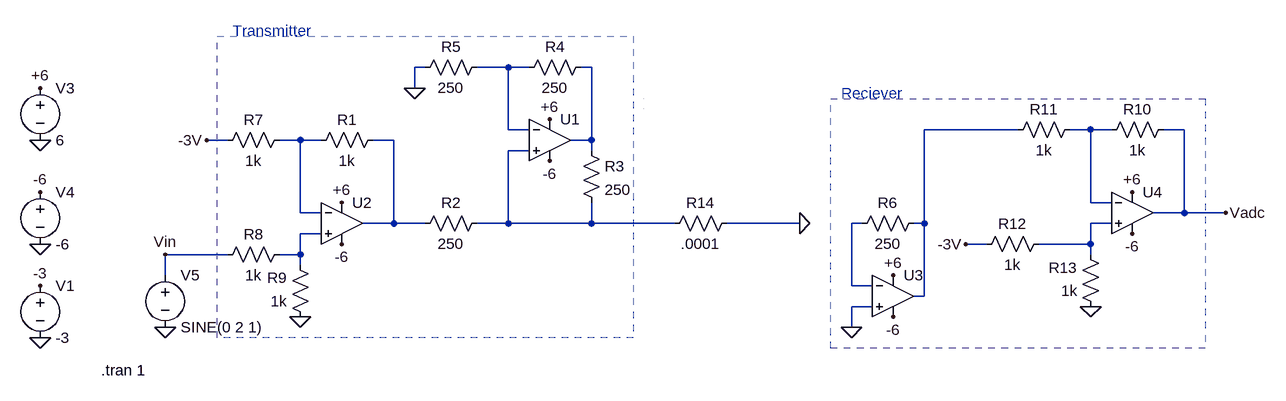
[diagram p0: schematic Draft1.asc]
Draft1.asc, the LTspice schematic file:
Version 4
SHEET 1 2096 688
WIRE 816 48 800 48
WIRE 944 48 896 48
WIRE 976 48 944 48
WIRE 1072 48 1056 48
WIRE 800 80 800 48
WIRE 944 144 944 48
WIRE 976 144 944 144
WIRE 1728 144 1584 144
WIRE 1840 144 1808 144
WIRE 1872 144 1840 144
WIRE 1984 144 1952 144
WIRE 512 160 480 160
WIRE 624 160 592 160
WIRE 656 160 624 160
WIRE 768 160 736 160
WIRE 1072 160 1072 48
WIRE 1072 160 1040 160
WIRE 976 176 944 176
WIRE 1072 176 1072 160
WIRE 1840 256 1840 144
WIRE 1872 256 1840 256
WIRE 624 272 624 160
WIRE 656 272 624 272
WIRE 1984 272 1984 144
WIRE 1984 272 1936 272
WIRE 2048 272 1984 272
WIRE 768 288 768 160
WIRE 768 288 720 288
WIRE 816 288 768 288
WIRE 944 288 944 176
WIRE 944 288 896 288
WIRE 1072 288 1072 256
WIRE 1072 288 944 288
WIRE 1200 288 1072 288
WIRE 1392 288 1280 288
WIRE 1488 288 1472 288
WIRE 1584 288 1584 144
WIRE 1584 288 1568 288
WIRE 1872 288 1840 288
WIRE 656 304 624 304
WIRE 1680 320 1648 320
WIRE 1840 320 1840 288
WIRE 1840 320 1760 320
WIRE 512 336 416 336
WIRE 624 336 624 304
WIRE 624 336 592 336
WIRE 1840 336 1840 320
WIRE 624 352 624 336
WIRE 416 368 416 336
WIRE 1472 384 1472 288
WIRE 1504 384 1472 384
WIRE 1584 400 1584 288
WIRE 1584 400 1568 400
WIRE 1504 416 1472 416
WIRE 1472 448 1472 416
FLAG 800 80 0
FLAG 224 320 0
FLAG 224 160 0
FLAG 688 256 +6
FLAG 688 320 -6
FLAG 416 448 0
FLAG 624 432 0
FLAG 1472 448 0
FLAG 1840 416 0
FLAG 1536 432 -6
FLAG 1008 192 -6
FLAG 1904 304 -6
FLAG 1008 128 +6
FLAG 1904 240 +6
FLAG 1536 368 +6
FLAG 224 240 -6
FLAG 224 80 +6
FLAG 480 160 -3V
FLAG 1648 320 -3V
FLAG 224 464 0
FLAG 224 384 -3
FLAG 2048 272 Vadc
FLAG 416 336 Vin
FLAG 1392 288 0
SYMBOL OpAmps\\UniversalOpamp2 1008 160 R0
SYMATTR InstName U1
SYMBOL res 912 272 R90
WINDOW 0 0 56 VBottom 2
WINDOW 3 32 56 VTop 2
SYMATTR InstName R2
SYMATTR Value 250
SYMBOL res 1072 32 R90
WINDOW 0 0 56 VBottom 2
WINDOW 3 32 56 VTop 2
SYMATTR InstName R4
SYMATTR Value 250
SYMBOL res 912 32 R90
WINDOW 0 0 56 VBottom 2
WINDOW 3 32 56 VTop 2
SYMATTR InstName R5
SYMATTR Value 250
SYMBOL res 1056 160 R0
SYMATTR InstName R3
SYMATTR Value 250
SYMBOL voltage 224 64 R0
WINDOW 123 0 0 Left 0
WINDOW 39 0 0 Left 0
SYMATTR InstName V3
SYMATTR Value 6
SYMBOL voltage 224 224 R0
WINDOW 123 0 0 Left 0
WINDOW 39 0 0 Left 0
SYMATTR InstName V4
SYMATTR Value -6
SYMBOL OpAmps\\UniversalOpamp2 688 288 R0
SYMATTR InstName U2
SYMBOL res 752 144 R90
WINDOW 0 0 56 VBottom 2
WINDOW 3 32 56 VTop 2
SYMATTR InstName R1
SYMATTR Value 1k
SYMBOL res 608 144 R90
WINDOW 0 0 56 VBottom 2
WINDOW 3 32 56 VTop 2
SYMATTR InstName R7
SYMATTR Value 1k
SYMBOL res 608 320 R90
WINDOW 0 0 56 VBottom 2
WINDOW 3 32 56 VTop 2
SYMATTR InstName R8
SYMATTR Value 1k
SYMBOL res 640 448 R180
WINDOW 0 36 76 Left 2
WINDOW 3 36 40 Left 2
SYMATTR InstName R9
SYMATTR Value 1k
SYMBOL voltage 416 352 R0
WINDOW 123 0 0 Left 0
WINDOW 39 0 0 Left 0
SYMATTR InstName V5
SYMATTR Value SINE(0 2 1)
SYMBOL res 1584 272 R90
WINDOW 0 0 56 VBottom 2
WINDOW 3 32 56 VTop 2
SYMATTR InstName R6
SYMATTR Value 250
SYMBOL OpAmps\\UniversalOpamp2 1536 400 R0
SYMATTR InstName U3
SYMBOL OpAmps\\UniversalOpamp2 1904 272 R0
SYMATTR InstName U4
SYMBOL res 1968 128 R90
WINDOW 0 0 56 VBottom 2
WINDOW 3 32 56 VTop 2
SYMATTR InstName R10
SYMATTR Value 1k
SYMBOL res 1824 128 R90
WINDOW 0 0 56 VBottom 2
WINDOW 3 32 56 VTop 2
SYMATTR InstName R11
SYMATTR Value 1k
SYMBOL res 1776 304 R90
WINDOW 0 0 56 VBottom 2
WINDOW 3 32 56 VTop 2
SYMATTR InstName R12
SYMATTR Value 1k
SYMBOL res 1856 432 R180
WINDOW 0 36 76 Left 2
WINDOW 3 36 40 Left 2
SYMATTR InstName R13
SYMATTR Value 1k
SYMBOL voltage 224 368 R0
WINDOW 123 0 0 Left 0
WINDOW 39 0 0 Left 0
SYMATTR InstName V1
SYMATTR Value -3
SYMBOL res 1296 272 R90
WINDOW 0 0 56 VBottom 2
WINDOW 3 32 56 VTop 2
SYMATTR InstName R14
SYMATTR Value .0001
TEXT 318 514 Left 2 !.tran 1
TEXT 520 -8 Left 2 ;Transmitter
TEXT 1456 88 Left 2 ;Reciever
RECTANGLE Normal 1152 96 1152 96 2
RECTANGLE Normal 1152 112 1152 112 2
RECTANGLE Normal 1136 464 496 0 2
RECTANGLE Normal 2016 480 1440 96 2

The netlist it stands for:
* Draft1.asc
XU1 N007 N001 +6 -6 N002 level.2 Avol=1Meg GBW=10Meg Slew=10Meg ilimit=25m rail=0 Vos=0 phimargin=45 en=0 enk=0 in=0 ink=0 Rin=500Meg  ; pins IN+ IN- V+ V- OUT
R2 N007 N006 250
R4 N002 N001 250
R5 N001 0 250
R3 N002 N007 250
V3 +6 0 6
V4 -6 0 -6
XU2 N010 N005 +6 -6 N006 level.2 Avol=1Meg GBW=10Meg Slew=10Meg ilimit=25m rail=0 Vos=0 phimargin=45 en=0 enk=0 in=0 ink=0 Rin=500Meg  ; pins IN+ IN- V+ V- OUT
R1 N006 N005 1k
R7 N005 -3V 1k
R8 N010 Vin 1k
R9 0 N010 1k
V5 Vin 0 SINE(0 2 1)
R6 N003 N008 250
XU3 0 N008 +6 -6 N003 level.2 Avol=1Meg GBW=10Meg Slew=10Meg ilimit=25m rail=0 Vos=0 phimargin=45 en=0 enk=0 in=0 ink=0 Rin=500Meg  ; pins IN+ IN- V+ V- OUT
XU4 N009 N004 +6 -6 Vadc level.2 Avol=1Meg GBW=10Meg Slew=10Meg ilimit=25m rail=0 Vos=0 phimargin=45 en=0 enk=0 in=0 ink=0 Rin=500Meg  ; pins IN+ IN- V+ V- OUT
R10 Vadc N004 1k
R11 N004 N003 1k
R12 N009 -3V 1k
R13 0 N009 1k
V1 -3 0 -3
R14 0 N007 .0001
.tran 1
* Transmitter
* Reciever
.lib UniversalOpamps2.sub
.backanno
.end